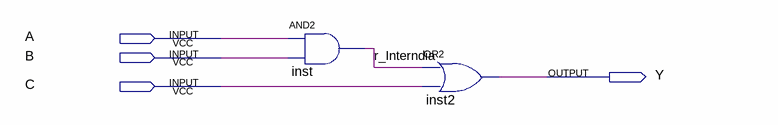
[diagram p0: schematic sheet]
// Quartus schematic tutorial1.bdf as structural Verilog: 2 symbols, 4 pins
module tutorial1 (
  input  A,
  input  B,
  input  C,
  output Y
);

  wire r_Interndia;

  and inst (r_Interndia, A, B);
  or inst2 (Y, r_Interndia, C);
endmodule
